# EAGLE design updown counter (EAGLE 9.6.2)
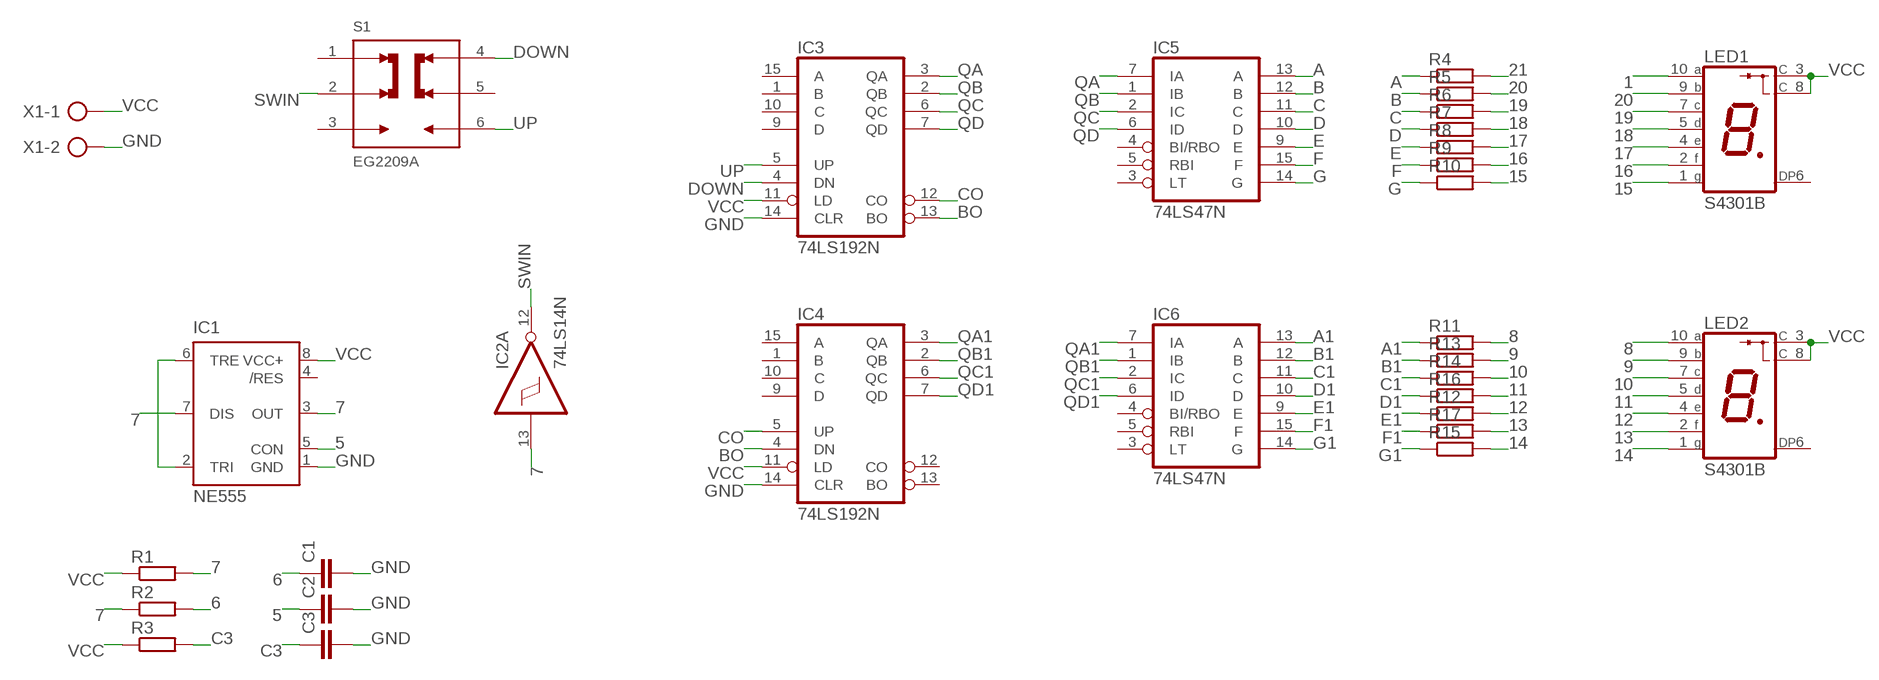
[diagram p0: schematic, sheet 1]

## Parts
C1  C-EU025-025X050  [C025-025X050]
C2  C-EU025-025X050  [C025-025X050]
C3  C-EU025-025X050  [C025-025X050]
IC1  NE555  [DIL-08]
IC2  74LS14N  [DIL14]
IC3  74LS192N  [DIL16]
IC4  74LS192N  [DIL16]
IC5  74LS47N  [DIL16]
IC6  74LS47N  [DIL16]
LED1  S4301B  [S4301B]
LED2  S4301B  [S4301B]
R1  R-EU_0207/10  [0207/10]
R2  R-EU_0207/10  [0207/10]
R3  R-EU_0207/10  [0207/10]
R4  R-EU_0207/10  [0207/10]
R5  R-EU_0207/10  [0207/10]
R6  R-EU_0207/10  [0207/10]
R7  R-EU_0207/10  [0207/10]
R8  R-EU_0207/10  [0207/10]
R9  R-EU_0207/10  [0207/10]
R10  R-EU_0207/10  [0207/10]
R11  R-EU_0207/10  [0207/10]
R12  R-EU_0207/10  [0207/10]
R13  R-EU_0207/10  [0207/10]
R14  R-EU_0207/10  [0207/10]
R15  R-EU_0207/10  [0207/10]
R16  R-EU_0207/10  [0207/10]
R17  R-EU_0207/10  [0207/10]
S1  EG2209A  [SW_EG2209A]
X1  AK300/2  [AK300/2]

## Nets
1: LED1.10(A)
5: C2.1 IC1.5(CON)
6: C1.1 R2.2
7: IC1.3(OUT) IC1.7(DIS) IC2.13(A:I) R1.2 R2.1
8: LED2.10(A) R11.2
9: LED2.9(B) R13.2
10: LED2.7(C) R14.2
11: LED2.5(D) R16.2
12: LED2.4(E) R12.2
13: LED2.2(F) R17.2
14: LED2.1(G) R15.2
15: LED1.1(G) R10.2
16: LED1.2(F) R9.2
17: LED1.4(E) R8.2
18: LED1.5(D) R7.2
19: LED1.7(C) R6.2
20: LED1.9(B) R5.2
21: R4.2
A: IC5.13(A) R4.1
A1: IC6.13(A) R11.1
B: IC5.12(B) R5.1
B1: IC6.12(B) R13.1
BO: IC3.13(BO) IC4.4(DN)
C: IC5.11(C) R6.1
C1: IC6.11(C) R14.1
C3: C3.1 R3.2
CO: IC3.12(CO) IC4.5(UP)
D: IC5.10(D) R7.1
D1: IC6.10(D) R16.1
DOWN: IC3.4(DN) S1.4
E: IC5.9(E) R8.1
E1: IC6.9(E) R12.1
F: IC5.15(F) R9.1
F1: IC6.15(F) R17.1
G: IC5.14(G) R10.1
G1: IC6.14(G) R15.1
GND: C1.2 C2.2 C3.2 IC1.1(GND) IC3.14(CLR) IC4.14(CLR) X1.2
N$15: IC1.2(TRI) IC1.6(TRE)
QA: IC3.3(QA) IC5.7(IA)
QA1: IC4.3(QA) IC6.7(IA)
QB: IC3.2(QB) IC5.1(IB)
QB1: IC4.2(QB) IC6.1(IB)
QC: IC3.6(QC) IC5.2(IC)
QC1: IC4.6(QC) IC6.2(IC)
QD: IC3.7(QD) IC5.6(ID)
QD1: IC4.7(QD) IC6.6(ID)
SWIN: IC2.12(A:O) S1.2
UP: IC3.5(UP) S1.6
VCC: IC1.8(VCC+) IC3.11(LD) IC4.11(LD) LED1.3(C) LED1.8(C) LED2.3(C) LED2.8(C) R1.1 R3.1 X1.1
Unconnected: IC1.4(/RES) IC2.1(D:I) IC2.2(D:O) IC2.3(E:I) IC2.4(E:O) IC2.5(F:I) IC2.6(F:O) IC2.8(C:O) IC2.9(C:I) IC2.10(B:O) IC2.11(B:I) IC3.1(B) IC3.9(D) IC3.10(C) IC3.15(A) IC4.1(B) IC4.9(D) IC4.10(C) IC4.12(CO) IC4.13(BO) IC4.15(A) IC5.3(LT) IC5.4(BI/RBO) IC5.5(RBI) IC6.3(LT) IC6.4(BI/RBO) IC6.5(RBI) LED1.6(DP) LED2.6(DP) S1.1 S1.3 S1.5

## Power pins joined to a net without a drawn wire
GND: IC2.7(P:GND) IC3.8(GND) IC4.8(GND) IC5.8(GND) IC6.8(GND)
VCC: IC2.14(P:VCC) IC3.16(VCC) IC4.16(VCC) IC5.16(VCC) IC6.16(VCC)

## Library data of the parts
C1-C3 = rcl:C-EU: CAPACITOR, European symbol; SPICEPREFIX: C
IC1 = st-microelectronics:NE555: General purpose bipolar Timer; MF: Arrow Electronics; MPN: NE555N; OC_FARNELL: 1467742; OC_NEWARK: 89K1486
IC2 = 74xx-eu:74*14: Hex schmitt trigger INVERTER
IC3 IC4 = 74xx-eu:74*192: Synchronous 4-bit UP/DOWN COUNTER
IC5 IC6 = 74xx-eu:74*47: BCD to seven segment DECODER/DRIVER Source: http://www.ee.washington.edu/stores/DataSheets/74ls/74ls47.pdf
LED1 LED2 = led-7-segment:S4301B: Single Digit Seven-Segment Display (cathode common) Source: LITEON .. S4301B.pdf; OC_FARNELL: unknown; OC_NEWARK: unknown
R1-R17 = rcl:R-EU_: RESISTOR, European symbol; SPICEPREFIX: R
S1 = EG2209A:EG2209A: Check availability <https://pricing.snapeda.com/parts/EG2209A/E-Switch/view-part?ref=eda>; AVAILABILITY: In Stock; CHECK_PRICES: https://www.snapeda.com/parts/EG2209A/E-Switch/view-part/?ref=eda; DESCRIPTION: Slide Switch DPDT Through Hole; MF: E-Switch; MP: EG2209A; PACKAGE: None; PRICE: None; SNAPEDA_LINK: https://www.snapeda.com/parts/EG2209A/E-Switch/view-part/?ref=snap
X1 = con-ptr500:AK300/2: CONNECTOR; OC_FARNELL: unknown; OC_NEWARK: unknown

## Board
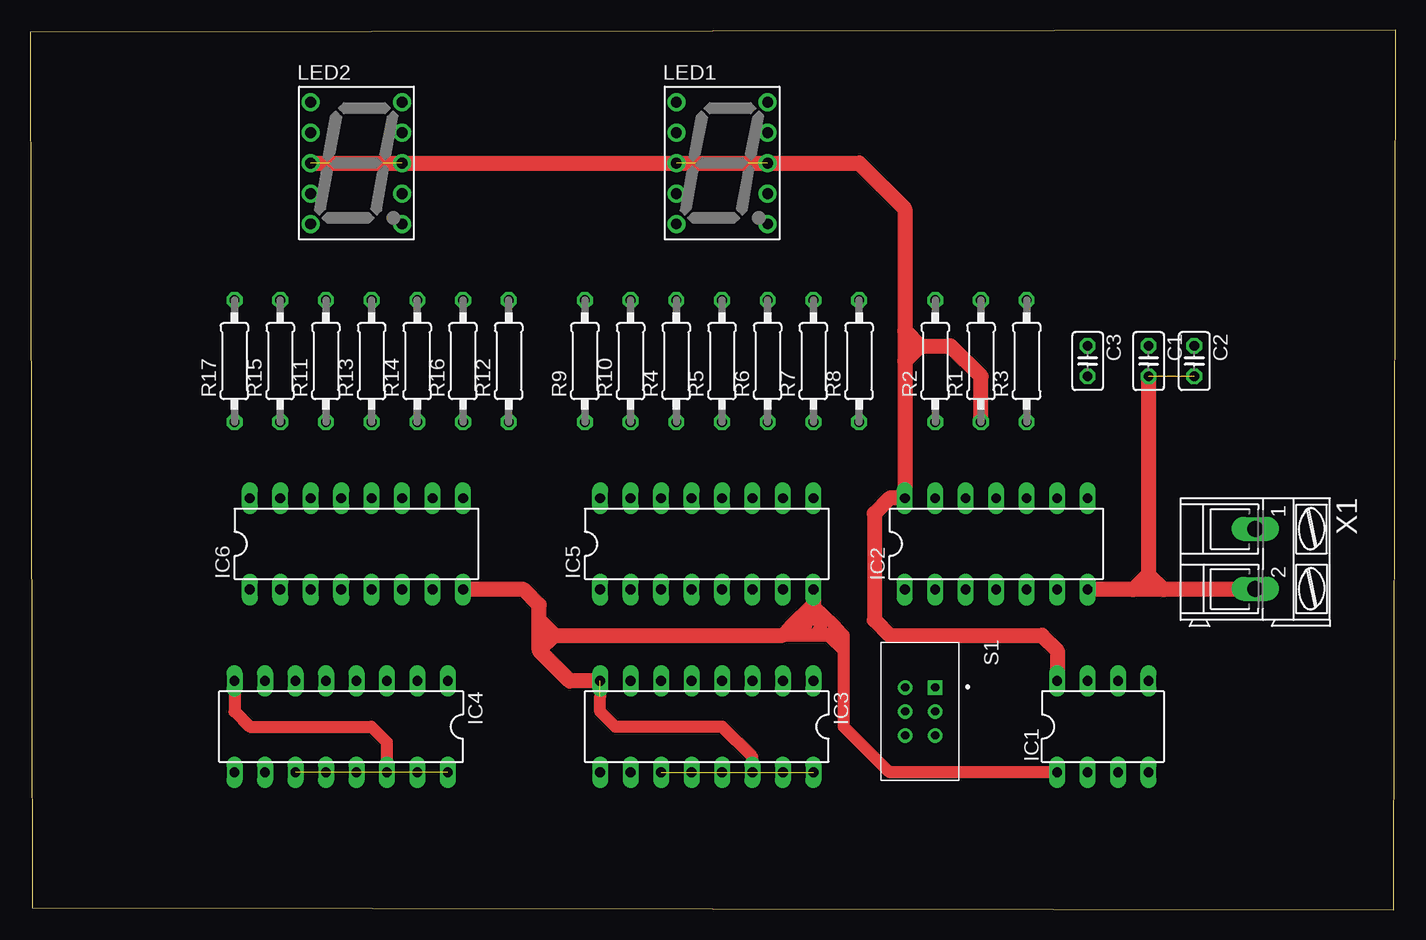
[diagram p1: board, top side]
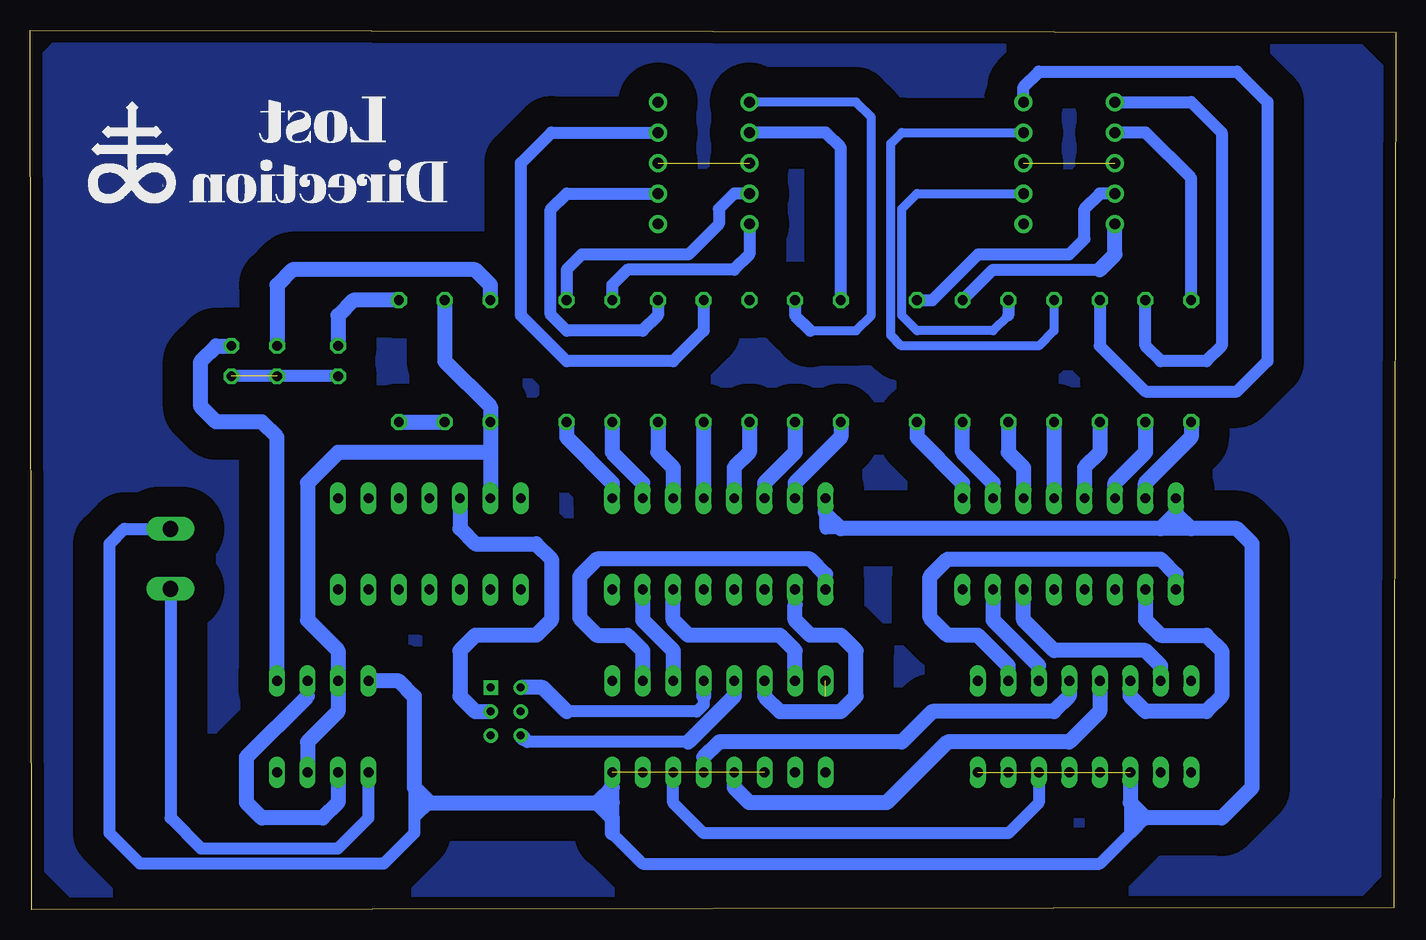
[diagram p2: board, bottom side, seen from below]

Size 113.85 x 73.34 mm. Coordinates in mm from the lower left corner, seen from the top.
Outline: 0.17,0.16 113.7,0 113.85,73.34 0,73.16 0.17,0.16
Copper layers (1*16): Top 0.035mm / dielectric 1.5mm / Bottom 0.035mm
Design rules "default *": minimum track width 6mil, minimum drill 0.35mm, track to track 100mil, track to pad 100mil, pad to pad 100mil, via to via 100mil, smd to smd 6mil, copper to edge 40mil, drill to drill 6mil, minimum pad ring 10mil, minimum via ring 8mil, stop-mask expansion 4mil, vias tented up to drill 0mil, thermal gap 10mil

### Footprints (pad centres in the part's own frame; a part is rotated, then mirrored left to right if it is on the bottom)
C025-025X050 = drill 0.813 octagon: 1 -1.27,0; 2 1.27,0
DIL-08 = drill 0.813 long: 1 -3.81,-3.81; 2 -1.27,-3.81; 3 1.27,-3.81; 4 3.81,-3.81; 5 3.81,3.81; 6 1.27,3.81; 7 -1.27,3.81; 8 -3.81,3.81
DIL14 = drill 0.813 long: 1 -7.62,-3.81; 2 -5.08,-3.81; 3 -2.54,-3.81; 4 0,-3.81; 5 2.54,-3.81; 6 5.08,-3.81; 7 7.62,-3.81; 8 7.62,3.81; 9 5.08,3.81; 10 2.54,3.81; 11 0,3.81; 12 -2.54,3.81; 13 -5.08,3.81; 14 -7.62,3.81
DIL16 = drill 0.813 long: 1 -8.89,-3.81; 2 -6.35,-3.81; 3 -3.81,-3.81; 4 -1.27,-3.81; 5 1.27,-3.81; 6 3.81,-3.81; 7 6.35,-3.81; 8 8.89,-3.81; 9 8.89,3.81; 10 6.35,3.81; 11 3.81,3.81; 12 1.27,3.81; 13 -1.27,3.81; 14 -3.81,3.81; 15 -6.35,3.81; 16 -8.89,3.81
S4301B = drill 0.9 pad 1.5: 1 -3.81,5.08; 2 -3.81,2.54; 3 -3.81,0; 4 -3.81,-2.54; 5 -3.81,-5.08; 6 3.81,-5.08; 7 3.81,-2.54; 8 3.81,0; 9 3.81,2.54; 10 3.81,5.08
0207/10 = drill 0.813 octagon: 1 -5.08,0; 2 5.08,0
SW_EG2209A = drill 0.7 square: 1 -2,1.25 | drill 0.7: 2 0,1.25; 3 2,1.25; 4 -2,-1.25; 5 0,-1.25; 6 2,-1.25
AK300/2 = drill 1.321 long: 1 -2.515,0; 2 2.489,0

### Placement (x,y rotation side)
C1  93.25,45.73 270 top
C2  97.06,45.73 270 top
C3  88.17,45.73 270 top
IC1  89.44,15.25 0 top
IC2  80.55,30.49 0 top
IC3  56.42,15.25 180 top
IC4  25.94,15.25 180 top
IC5  56.42,30.49 0 top
IC6  27.21,30.49 0 top
LED1  57.69,62.24 0 top
LED2  27.21,62.24 0 top
R1  79.28,45.73 90 top
R2  75.47,45.73 90 top
R3  83.09,45.73 90 top
R4  53.88,45.73 90 top
R5  57.69,45.73 90 top
R6  61.5,45.73 90 top
R7  65.31,45.73 90 top
R8  69.12,45.73 90 top
R9  46.26,45.73 90 top
R10  50.07,45.73 90 top
R11  24.67,45.73 90 top
R12  39.91,45.73 90 top
R13  28.48,45.73 90 top
R14  32.29,45.73 90 top
R15  20.86,45.73 90 top
R16  36.1,45.73 90 top
R17  17.05,45.73 90 top
S1  74.2,16.52 270 top
X1  102.14,29.22 270 top

### Tracks (layer width: path | path; a pad name or v marks a point on that pad's centre or on a via)
5
  Bottom 1.27: IC1.5 93.25,39.38 94.52,40.65 98.33,40.65 99.6,41.92 99.6,45.73 98.33,47 C2.1
6
  Bottom 1.27: R2.2 75.47,52.08 76.74,53.35 91.98,53.35 93.25,52.08 C1.1
7
  Bottom 0.152: 75.47,38.11 R2.1 75.47,41.92 | 88.17,21.6 IC1.7 88.17,16.52
  Bottom 1.27: R1.2 79.28,45.73 75.47,41.92 75.47,38.11 | 75.47,38.11 IC2.13 | 75.47,38.11 88.17,38.11 90.71,35.57 90.71,24.14 88.17,21.6 88.17,16.52 90.71,13.98 IC1.3
8
  Bottom 1.016: R11.2 24.67,47 20.86,43.19 13.24,43.19 10.7,45.73 10.7,67.32 13.24,69.86 29.75,69.86 31.02,68.59 LED2.10
9
  Bottom 0.762: R13.2 28.48,48.27 29.75,47 41.2,47 42.09,47.89 42.09,63.87 41.18,64.78 LED2.9
10
  Bottom 0.762: 32.29,49.54 33.56,48.27 39.91,48.27 41.18,49.54 41.18,58.43 39.91,59.7 LED2.7
  Bottom 1.016: R14.2 32.29,49.54
11
  Bottom 1.016: R16.2 33.56,53.35 24.67,53.35
  Bottom 1.27: 24.67,53.35 23.4,54.62 LED2.5
12
  Bottom 1.016: LED2.4 24.67,59.7 25.94,58.43 25.94,55.92 27.21,54.65 34.8,54.65 38.64,50.81 R12.2
13
  Bottom 1.016: R17.2 17.05,60.97 20.86,64.78 LED2.2
14
  Bottom 1.016: LED2.1 17.05,67.32 14.51,64.78 14.51,47 15.78,45.73 19.59,45.73 20.86,47 R15.2
15
  Bottom 0.762: 48.8,48.27 44.99,48.27 43.72,49.54 43.72,66.05 44.99,67.32 LED1.1
  Bottom 1.016: R10.2 50.07,49.54 48.8,48.27
16
  Bottom 1.016: R9.2 46.26,63.51 47.53,64.78 LED1.2
17
  Bottom 1.016: LED1.4 55.15,59.7 56.42,58.43 56.42,57.16 58.96,54.62 67.85,54.62 69.12,53.35 R8.2
18
  Bottom 1.016: LED1.5 53.88,54.62 55.15,53.35 64.04,53.35 65.31,52.08 R7.2
19
  Bottom 1.016: R6.2 61.5,49.54 62.77,48.27 69.12,48.27 70.44,49.59 70.44,58.38 69.12,59.7 LED1.7
20
  Bottom 1.016: LED1.9 70.39,64.78 72.93,62.24 72.93,49.54 69.12,45.73 60.23,45.73 57.69,48.27 R5.2
A
  Bottom 1.27: R4.1 53.88,38.11 55.15,36.84 IC5.13
A1
  Bottom 1.27: R11.1 24.67,38.11 25.94,36.84 IC6.13
B
  Bottom 0.152: R5.1 57.69,35.57
  Bottom 1.27: R5.1 IC5.12
B1
  Bottom 1.27: R13.1 IC6.12
BO
  Bottom 1.016: IC3.13 57.69,12.71
  Bottom 1.27: IC4.4 27.21,17.79 28.48,16.52 38.64,16.52 41.18,13.98 56.42,13.98 57.69,12.71
C
  Bottom 0.152: 60.23,36.84 60.23,35.57
  Bottom 1.27: R6.1 61.5,38.11 60.23,36.84 IC5.11
C1
  Bottom 0.152: 31.02,36.84 31.02,35.57
  Bottom 1.27: R14.1 32.29,38.11 31.02,36.84 IC6.11
C3
  Bottom 1.27: R3.2 86.9,50.81 88.17,49.54 C3.1
CO
  Bottom 1.27: IC4.5 24.67,16.52 27.21,13.98 37.37,13.98 42.45,8.9 53.88,8.9 55.15,10.17 IC3.12
D
  Bottom 0.762: IC5.10 62.77,35.57
  Bottom 1.27: R7.1 65.31,38.11 62.77,35.57
D1
  Bottom 1.27: IC6.10 33.56,35.57 36.1,38.11 R16.1
DOWN
  Bottom 0.152: 72.93,18.52 S1.4
  Bottom 1.016: IC3.4 57.69,17.08 58.25,16.52 69.12,16.52
  Bottom 1.27: IC3.4 57.69,17.79 | 72.93,18.52 71.12,18.52 69.12,16.52
E
  Bottom 1.27: R8.1 69.12,39.38 65.31,35.57 IC5.9
E1
  Bottom 1.27: R12.1 39.91,39.38 36.1,35.57 IC6.9
F
  Bottom 1.27: R9.1 46.26,39.38 50.07,35.57 IC5.15
F1
  Bottom 1.27: R17.1 17.05,39.38 20.86,35.57 IC6.15
G
  Bottom 1.27: R10.1 50.07,38.11 52.61,35.57 IC5.14
G1
  Bottom 1.27: R15.1 20.86,38.11 23.4,35.57 IC6.14
GND  (2 unrouted)
  Top 1.016: IC1.1 71.66,11.44 67.85,15.25 67.85,21.6 | 67.85,22.87 67.21,23.51 | 67.21,23.51 65.94,24.78 | 65.94,24.78 65.31,25.41 | 67.85,21.6 67.85,22.87 | 62.77,22.87 64.04,22.87 | 64.04,22.87 65.31,22.87 | 65.31,22.87 66.58,22.87 | 67.21,23.51 66.58,22.87 | 66.58,22.87 67.85,22.87 | 65.94,24.78 65.94,24.14 | 65.94,24.14 65.94,23.51 65.31,22.87 | 65.94,24.14 64.04,24.14 | 63.4,23.51 64.67,24.78 | 64.67,24.78 65.94,24.78 | 64.67,24.78 64.67,23.51 64.04,22.87 | 66.58,22.87 67.85,21.6 | IC3.14 60.23,12.71 57.69,15.25 48.8,15.25 47.53,16.52 47.53,17.79 | IC4.8 17.05,16.52 18.32,15.25 28.48,15.25 29.75,13.98 IC4.14
  Top 1.27: C1.2 93.25,27.95 | 102.09,26.68 102.14,26.68 | X1.2 102.09,26.68 | 102.09,26.68 94.52,26.68 | 94.52,26.68 91.98,26.68 | 91.98,26.68 IC2.7 | 91.98,26.68 93.25,27.95 | 93.25,27.95 94.52,26.68 | IC3.8 44.99,19.06 42.45,21.6 | 42.45,21.6 42.45,22.87 | 42.45,22.87 42.45,24.14 | 42.45,24.14 42.45,25.41 41.18,26.68 IC6.8 | IC5.8 65.31,25.41 64.67,24.78 64.04,24.14 63.4,23.51 62.77,22.87 43.72,22.87 | 43.72,22.87 42.45,22.87 | 42.45,24.14 43.72,22.87 | 43.72,22.87 42.45,21.6
  Bottom 1.016: C3.2 C2.2 | IC4.14 29.75,8.9 32.29,6.36 57.69,6.36 60.23,8.9 IC3.14 | X1.2 102.14,7.63 99.6,5.09 88.17,5.09 85.63,7.63 IC1.1
N$15
  Bottom 0.152: 90.71,17.79 IC1.6
  Bottom 1.27: IC1.2 88.17,8.9 89.44,7.63 94.52,7.63 95.79,8.9 95.79,12.71 90.71,17.79
QA
  Bottom 1.27: IC5.7 62.77,24.14 60.23,21.6 IC3.3
QA1
  Bottom 0.152: 29.75,20.33 IC4.3
  Bottom 1.27: IC6.7 33.56,24.14 29.75,20.33
QB
  Bottom 1.27: IC5.1 47.53,27.95 48.8,29.22 66.58,29.22 68.03,27.77 68.03,24.32 66.58,22.87 64.04,22.87 62.77,21.6 IC3.2
QB1
  Bottom 1.27: IC4.2 32.29,20.33 34.83,22.87 37.37,22.87 38.82,24.32 38.82,27.77 37.37,29.22 19.59,29.22 18.32,27.95 IC6.1
QC
  Bottom 0.152: 50.07,25.41 IC5.2
  Bottom 1.27: IC3.6 52.61,17.79 51.34,16.52 46.26,16.52 44.99,17.79 44.99,21.6 46.26,22.87 48.8,22.87 50.07,24.14 50.07,25.41
QC1
  Bottom 1.27: IC6.2 20.86,24.14 19.59,22.87 15.78,22.87 14.51,21.6 14.51,17.79 15.78,16.52 20.86,16.52 22.13,17.79 IC4.6
QD
  Bottom 1.27: IC3.7 50.07,21.6 51.34,22.87 58.96,22.87 60.23,24.14 IC5.6
QD1
  Bottom 1.27: IC4.7 19.59,20.33 20.86,21.6 28.48,21.6 31.02,24.14 IC6.6
S
  pour Bottom: 0.2,68.89 4.46,73.15 4.62,73.15 109.13,73.15 110.44,73.15 113.39,70.21 113.39,4.54 109.13,0.28 4.3,0.28 0.2,4.38 -0.12,4.7 -0.12,68.89
SWIN
  Bottom 0.152: 75.47,16.52 S1.2
  Bottom 1.27: IC2.12 78.01,31.76 76.74,30.49 71.66,30.49 70.39,29.22 70.39,24.14 71.66,22.87 76.74,22.87 78.01,21.6 78.01,17.79 76.74,16.52 75.47,16.52
UP
  Bottom 1.016: 58.96,13.98 72.41,13.98 72.67,14.24
  Bottom 1.27: IC3.5 55.15,17.79 58.96,13.98 | S1.6 72.67,14.24
VCC  (4 unrouted)
  Top 1.27: LED2.3 LED1.8 69.12,62.24 72.93,58.43 72.93,48.27 | R1.1 79.28,44.46 76.74,47 74.2,47 | 72.93,48.27 74.2,47 | 72.93,48.27 72.93,45.73 | 72.93,45.73 74.2,47 | 72.93,45.73 IC2.14 71.66,34.3 70.39,33.03 70.39,24.14 71.66,22.87 84.36,22.87 85.63,21.6 IC1.8
  Bottom 1.016: 65.31,8.9 65.31,6.36 62.77,3.82 24.67,3.82 22.13,6.36 | 22.13,6.36 22.13,8.9 | 81.82,10.17 81.82,7.63 | 81.82,7.63 81.82,6.36 84.36,3.82 104.68,3.82 107.22,6.36 107.22,30.49 105.97,31.74 X1.1 | 80.55,8.9 81.82,7.63 | 20.86,7.63 22.13,6.36 | 46.26,31.76 47.53,31.76 IC5.16
  Bottom 1.27: 18.32,33.03 19.59,31.76 | 19.59,31.76 46.26,31.76 47.53,33.03 IC5.16 | IC6.16 18.32,33.03 | 18.32,33.03 17.05,31.76 | IC4.11 22.13,8.9 20.86,7.63 14.51,7.63 11.97,10.17 11.97,30.49 13.24,31.76 19.59,31.76 | IC1.8 83.09,19.06 81.82,17.79 81.82,10.17 80.55,8.9 66.58,8.9 | 65.31,10.17 65.94,9.54 | 65.94,9.54 66.58,8.9 | R3.1 R1.1 | 65.94,9.54 65.31,8.9 | 66.58,8.9 65.31,8.9 | 65.31,8.9 65.31,10.17 | 65.31,10.17 IC3.16 | 66.58,8.9 65.31,7.63 | 65.31,7.63 65.31,6.36 | 65.31,7.63 65.31,8.9